# EAGLE design AncientFilter-euro (EAGLE 7.7.0)

## Sheet 1 of 2
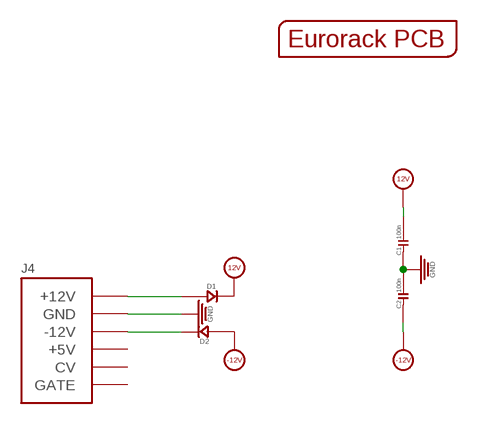
[diagram p0: schematic, sheet 1]

### Parts
C1  100n  C-0603  [C0603]
C2  100n  C-0603  [C0603]
D1  D-SMA  [DO-214AC]
D2  D-SMA  [DO-214AC]
J4  POWERSHROUDED  [POWER_16_SHROUDED]
PCB1  EURORACK_PCB12HP  [EURORACK12HPPCB]

### Nets
12V [power]: C1.2 D1.2(-) ; also sheet 2
-12V [power]: C2.1 D2.1(+) ; also sheet 2
GND: C1.1 C2.2 J4.3(GND) J4.4(GND) J4.5(GND) J4.6(GND) J4.7(GND) J4.8(GND) ; also sheet 2
N$2 [power]: D1.1(+) J4.9(+12V) J4.10(+12V)
N$3 [power]: D2.2(-) J4.1(-12V) J4.2(-12V)
Unconnected: J4.11(+5V) J4.12(+5V) J4.13(CV) J4.14(CV) J4.15(GATE) J4.16(GATE)

## Sheet 2 of 2
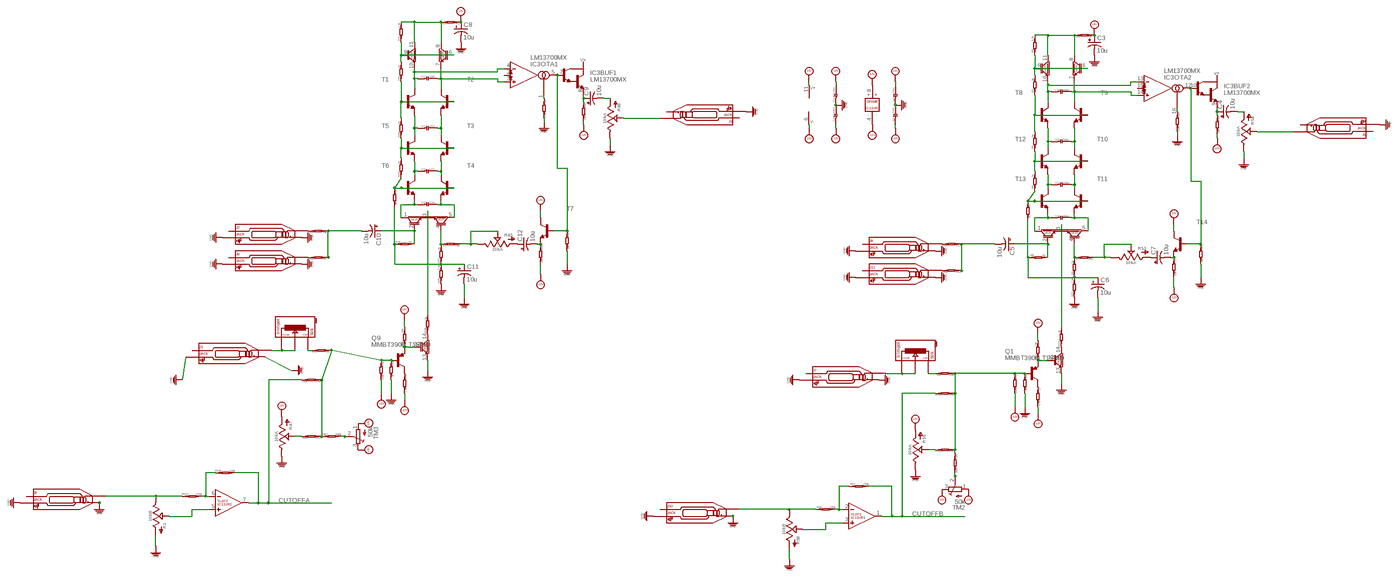
[diagram p1: schematic, sheet 2, overview]
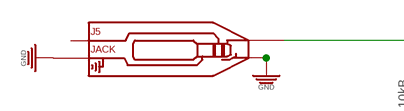
[diagram p2: schematic, sheet 2, part 1 of 4]
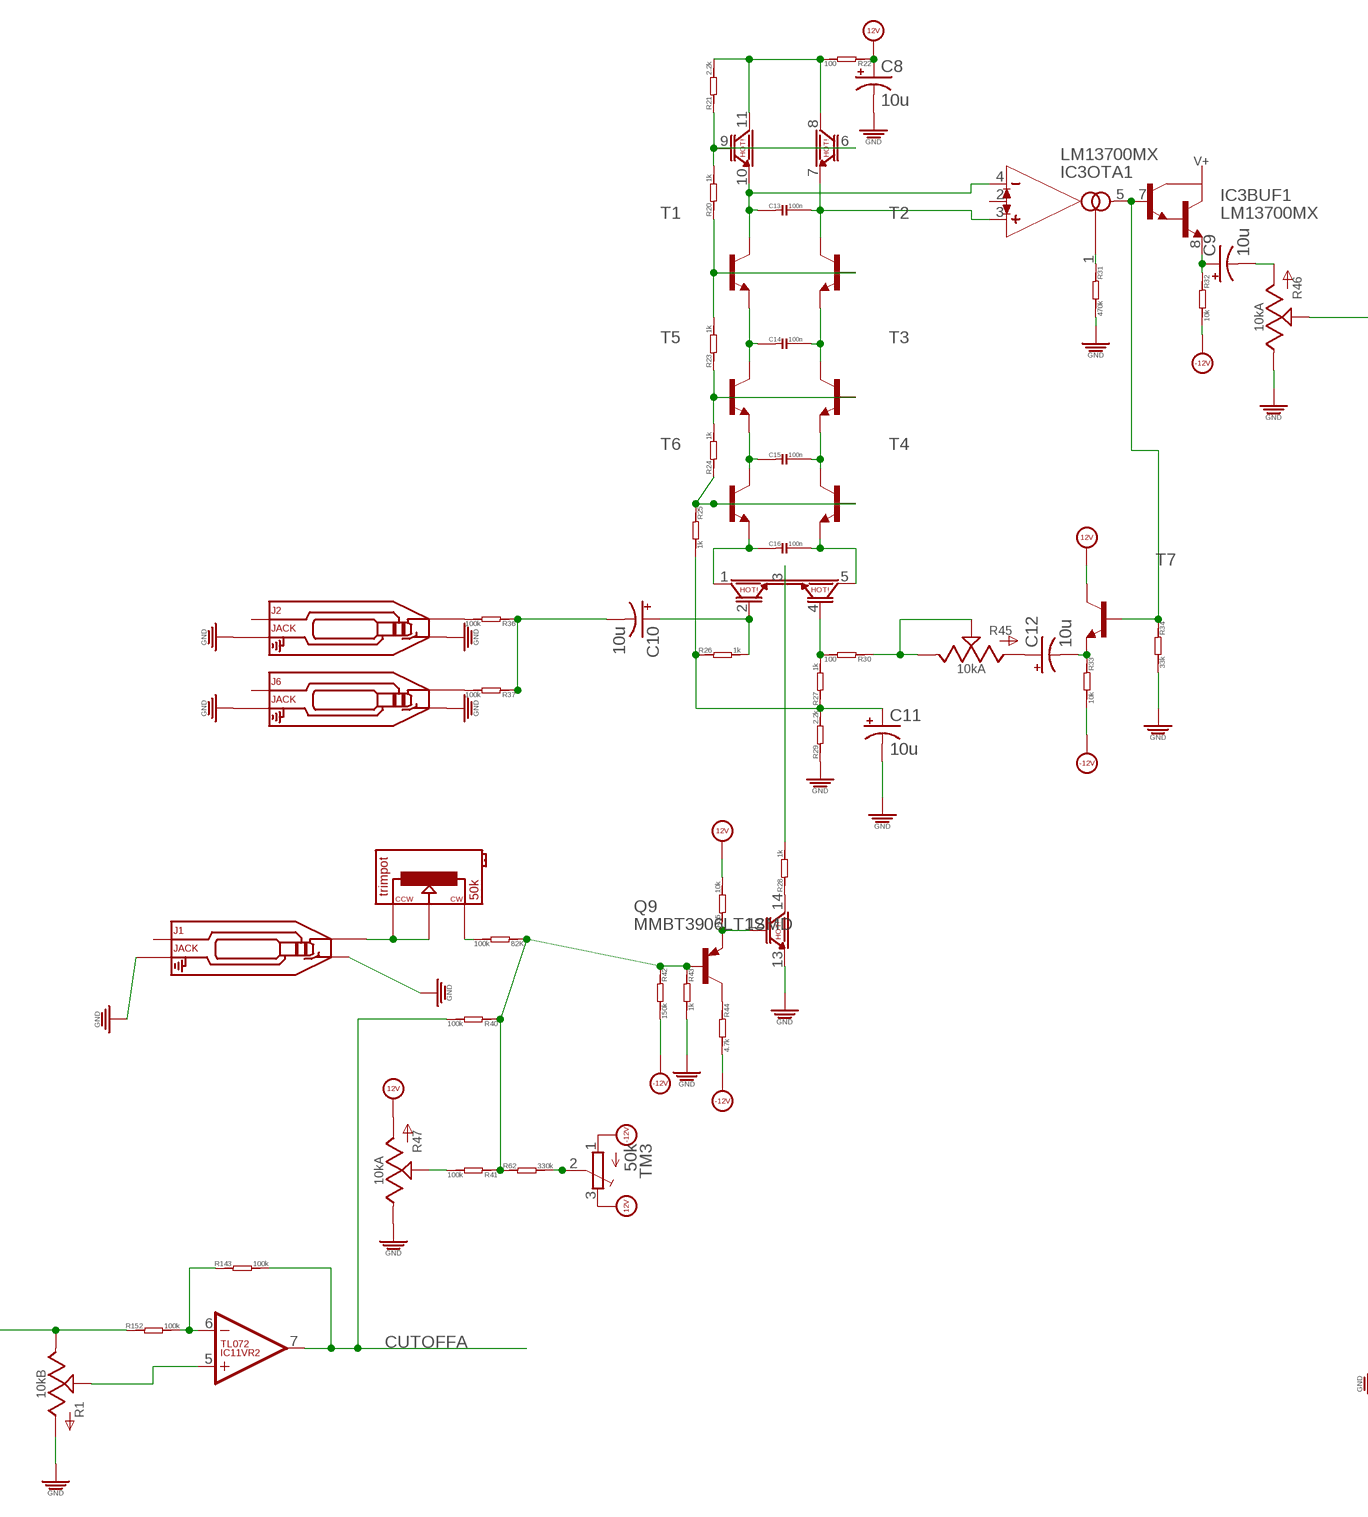
[diagram p3: schematic, sheet 2, part 2 of 4]
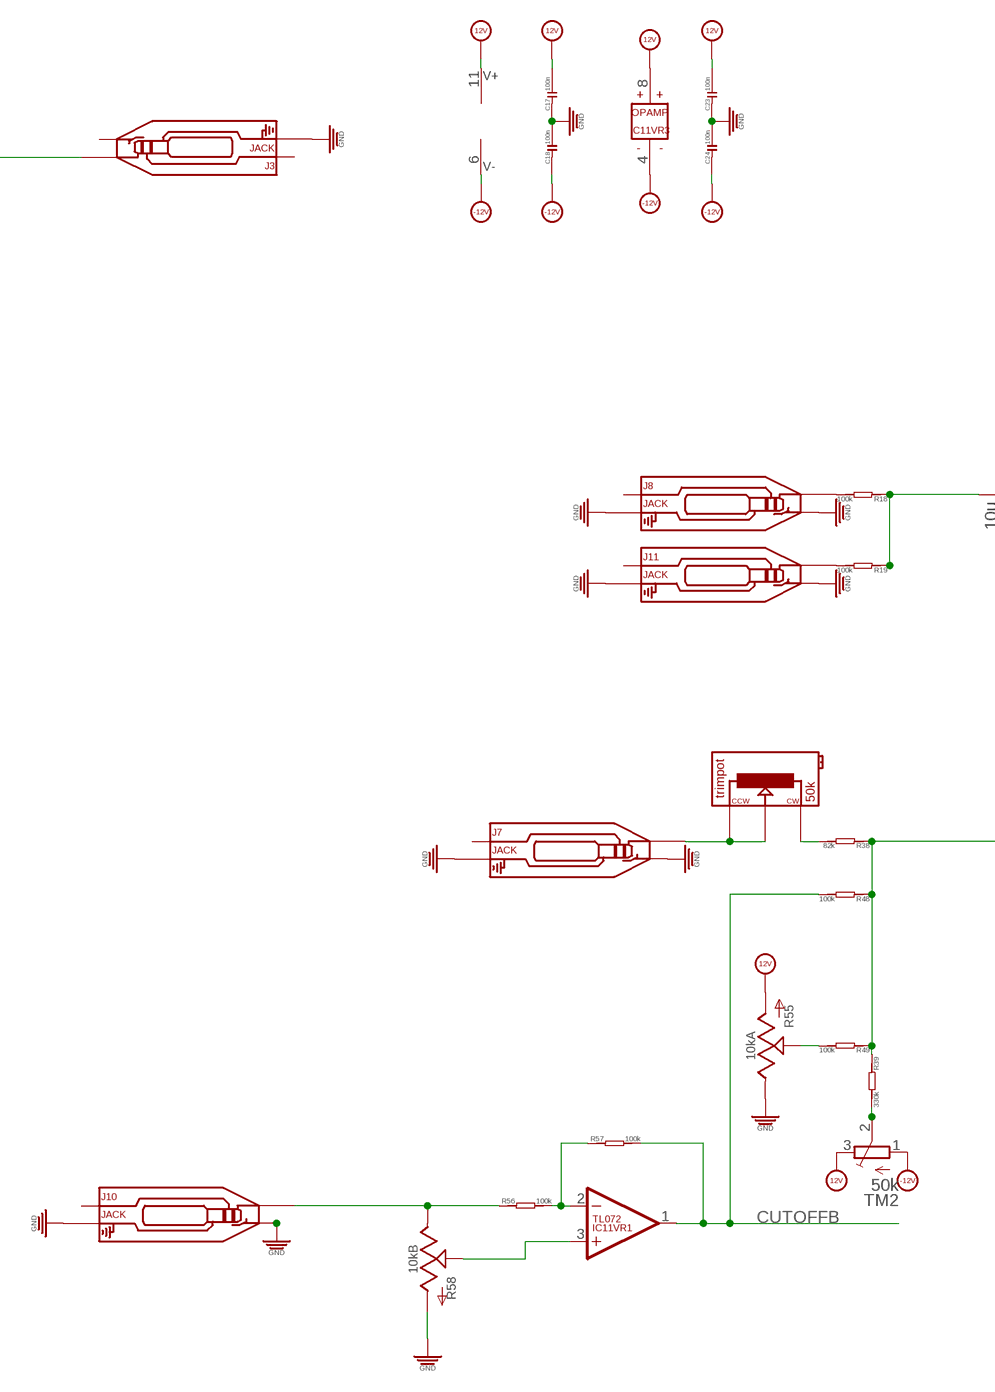
[diagram p4: schematic, sheet 2, part 3 of 4]
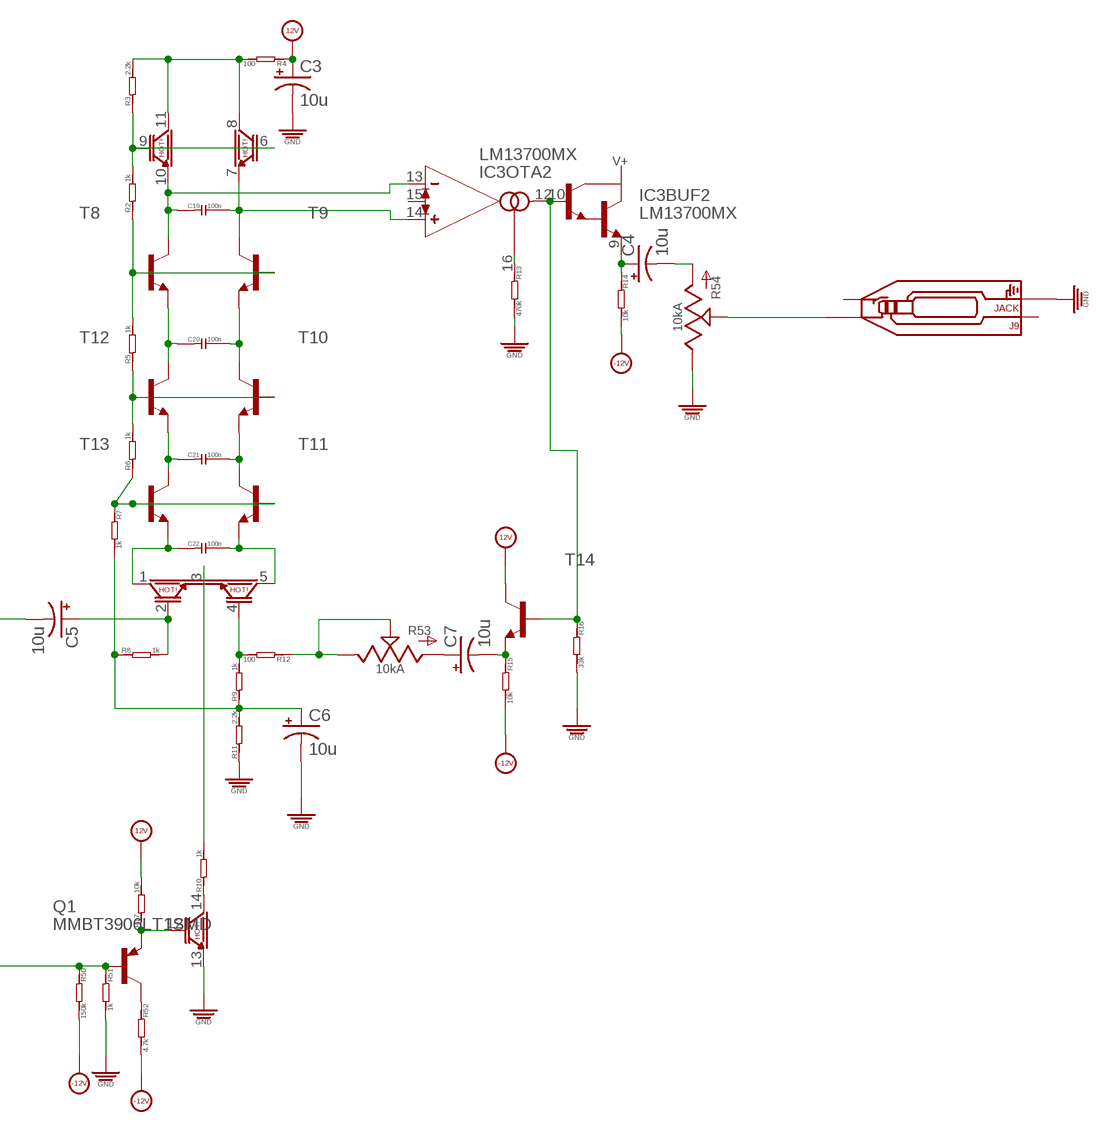
[diagram p5: schematic, sheet 2, part 4 of 4]

### Parts
82K  100k  R-0603  [R0603]
C3  10u  CPOL-US153CLV-0605  [153CLV-0605]
C4  10u  CPOL-US153CLV-0605  [153CLV-0605]
C5  10u  CPOL-US153CLV-0605  [153CLV-0605]
C6  10u  CPOL-US153CLV-0605  [153CLV-0605]
C7  10u  CPOL-US153CLV-0605  [153CLV-0605]
C8  10u  CPOL-US153CLV-0605  [153CLV-0605]
C9  10u  CPOL-US153CLV-0605  [153CLV-0605]
C10  10u  CPOL-US153CLV-0605  [153CLV-0605]
C11  10u  CPOL-US153CLV-0605  [153CLV-0605]
C12  10u  CPOL-US153CLV-0605  [153CLV-0605]
C13  100n  C-0603  [C0603]
C14  100n  C-0603  [C0603]
C15  100n  C-0603  [C0603]
C16  100n  C-0603  [C0603]
C17  100n  C-0603  [C0603]
C18  100n  C-0603  [C0603]
C19  100n  C-0603  [C0603]
C20  100n  C-0603  [C0603]
C21  100n  C-0603  [C0603]
C22  100n  C-0603  [C0603]
C23  100n  C-0603  [C0603]
C24  100n  C-0603  [C0603]
IC3  LM13700MX  [SO16]
IC11  TL072  [SO08]
J1  JACK  AUDIO-JACK_SMALLSYMBOLNODRILL  [3.5MM-JACK-SWITCH-13MM-NOHOLES]
J2  JACK  AUDIO-JACK_SMALLSYMBOLNODRILL  [3.5MM-JACK-SWITCH-13MM-NOHOLES]
J3  JACK  AUDIO-JACK_SMALLSYMBOLNODRILL  [3.5MM-JACK-SWITCH-13MM-NOHOLES]
J5  JACK  AUDIO-JACK_SMALLSYMBOLNODRILL  [3.5MM-JACK-SWITCH-13MM-NOHOLES]
J6  JACK  AUDIO-JACK_SMALLSYMBOLNODRILL  [3.5MM-JACK-SWITCH-13MM-NOHOLES]
J7  JACK  AUDIO-JACK_SMALLSYMBOLNODRILL  [3.5MM-JACK-SWITCH-13MM-NOHOLES]
J8  JACK  AUDIO-JACK_SMALLSYMBOLNODRILL  [3.5MM-JACK-SWITCH-13MM-NOHOLES]
J9  JACK  AUDIO-JACK_SMALLSYMBOLNODRILL  [3.5MM-JACK-SWITCH-13MM-NOHOLES]
J10  JACK  AUDIO-JACK_SMALLSYMBOLNODRILL  [3.5MM-JACK-SWITCH-13MM-NOHOLES]
J11  JACK  AUDIO-JACK_SMALLSYMBOLNODRILL  [3.5MM-JACK-SWITCH-13MM-NOHOLES]
Q1  MMBT3906LT1SMD  [SOT23-BEC]
Q9  MMBT3906LT1SMD  [SOT23-BEC]
R1  10kB  POTSQUAREHOLE_SMALLKNOB  [ALPS_POT_SQUAREHOLES]
R2  1k  R-0603  [R0603]
R3  2.2k  R-0603  [R0603]
R4  100  R-0603  [R0603]
R5  1k  R-0603  [R0603]
R6  1k  R-0603  [R0603]
R7  1k  R-0603  [R0603]
R8  1k  R-0603  [R0603]
R9  1k  R-0603  [R0603]
R10  1k  R-0603  [R0603]
R11  2.2k  R-0603  [R0603]
R12  100  R-0603  [R0603]
R13  470k  R-0603  [R0603]
R14  10k  R-0603  [R0603]
R15  10k  R-0603  [R0603]
R16  33k  R-0603  [R0603]
R17  10k  R-0603  [R0603]
R18  100k  R-0603  [R0603]
R19  100k  R-0603  [R0603]
R20  1k  R-0603  [R0603]
R21  2.2k  R-0603  [R0603]
R22  100  R-0603  [R0603]
R23  1k  R-0603  [R0603]
R24  1k  R-0603  [R0603]
R25  1k  R-0603  [R0603]
R26  1k  R-0603  [R0603]
R27  1k  R-0603  [R0603]
R28  1k  R-0603  [R0603]
R29  2.2k  R-0603  [R0603]
R30  100  R-0603  [R0603]
R31  470k  R-0603  [R0603]
R32  10k  R-0603  [R0603]
R33  10k  R-0603  [R0603]
R34  33k  R-0603  [R0603]
R35  10k  R-0603  [R0603]
R36  100k  R-0603  [R0603]
R37  100k  R-0603  [R0603]
R38  82k  R-0603  [R0603]
R39  330k  R-0603  [R0603]
R40  100k  R-0603  [R0603]
R41  100k  R-0603  [R0603]
R42  150k  R-0603  [R0603]
R43  1k  R-0603  [R0603]
R44  4.7k  R-0603  [R0603]
R45  10kA  POTSQUAREHOLE_SMALLKNOB  [ALPS_POT_SQUAREHOLES]
R46  10kA  POTSQUAREHOLE_SMALLKNOB  [ALPS_POT_SQUAREHOLES]
R47  10kA  POTSQUAREHOLE_SMALLKNOB  [ALPS_POT_SQUAREHOLES]
R48  100k  R-0603  [R0603]
R49  100k  R-0603  [R0603]
R50  150k  R-0603  [R0603]
R51  1k  R-0603  [R0603]
R52  4.7k  R-0603  [R0603]
R53  10kA  POTSQUAREHOLE_SMALLKNOB  [ALPS_POT_SQUAREHOLES]
R54  10kA  POTSQUAREHOLE_SMALLKNOB  [ALPS_POT_SQUAREHOLES]
R55  10kA  POTSQUAREHOLE_SMALLKNOB  [ALPS_POT_SQUAREHOLES]
R56  100k  R-0603  [R0603]
R57  100k  R-0603  [R0603]
R58  10kB  POTSQUAREHOLE_SMALLKNOB  [ALPS_POT_SQUAREHOLES]
R61  50k  TRIMPOT  [TRIMPOT]
R62  330k  R-0603  [R0603]
R63  50k  TRIMPOT  [TRIMPOT]
R143  100k  R-0603  [R0603]
R152  100k  R-0603  [R0603]
T1  MMBT3904LT1-NPN-SOT23-BEC  [SOT23-BEC]
T2  MMBT3904LT1-NPN-SOT23-BEC  [SOT23-BEC]
T3  MMBT3904LT1-NPN-SOT23-BEC  [SOT23-BEC]
T4  MMBT3904LT1-NPN-SOT23-BEC  [SOT23-BEC]
T5  MMBT3904LT1-NPN-SOT23-BEC  [SOT23-BEC]
T6  MMBT3904LT1-NPN-SOT23-BEC  [SOT23-BEC]
T7  MMBT3904LT1-NPN-SOT23-BEC  [SOT23-BEC]
T8  MMBT3904LT1-NPN-SOT23-BEC  [SOT23-BEC]
T9  MMBT3904LT1-NPN-SOT23-BEC  [SOT23-BEC]
T10  MMBT3904LT1-NPN-SOT23-BEC  [SOT23-BEC]
T11  MMBT3904LT1-NPN-SOT23-BEC  [SOT23-BEC]
T12  MMBT3904LT1-NPN-SOT23-BEC  [SOT23-BEC]
T13  MMBT3904LT1-NPN-SOT23-BEC  [SOT23-BEC]
T14  MMBT3904LT1-NPN-SOT23-BEC  [SOT23-BEC]
TM2  50k  TRIMPOTTC33X  [TC33X]
TM3  50k  TRIMPOTTC33X  [TC33X]
U$1  LM3046  [SO14]
U$2  LM3046  [SO14]

### Nets
12V [power]: C3.+ C8.+ C17.2 C23.2 IC3.11(SUPPLY:V+) IC11.8(VR3:V+) R4.1 R17.2 R22.1 R35.2 R47.P$3(A) R55.P$3(A) T7.C T14.C TM2.3(E) TM3.3(E) ; also sheet 1
-12V [power]: C18.1 C24.1 IC3.6(SUPPLY:V-) IC11.4(VR3:V-) R14.2 R15.2 R32.2 R33.2 R42.2 R44.2 R50.2 R52.2 TM2.1(A) TM3.1(A) ; also sheet 1
CUTOFF2_MODENVINPUT: J5.TIP_B@1(TIP) J5.TIP_T@3(TIP) R1.P$1(E) R152.1
CUTOFF2_MODENVINPUT1: J10.TIP_B@1(TIP) J10.TIP_T@3(TIP) R56.1 R58.P$1(E)
CUTOFFA: IC11.7(VR2:OUT) R40.2 R143.2
CUTOFFB: IC11.1(VR1:OUT) R48.2 R57.2
GND: C3.- C6.- C8.- C11.- C17.1 C18.2 C23.1 C24.2 J1.RING_B@1(RING) J1.RING_T@3(RING) J1.SWITCH_B@1(SWITCH) J1.SWITCH_T@3(SWITCH) J2.RING_B@1(RING) J2.RING_T@3(RING) J2.SWITCH_B@1(SWITCH) J2.SWITCH_T@3(SWITCH) J3.RING_B@1(RING) J3.RING_T@3(RING) J5.RING_B@1(RING) J5.RING_T@3(RING) J5.SWITCH_B@1(SWITCH) J5.SWITCH_T@3(SWITCH) J6.RING_B@1(RING) J6.RING_T@3(RING) J6.SWITCH_B@1(SWITCH) J6.SWITCH_T@3(SWITCH) J7.RING_B@1(RING) J7.RING_T@3(RING) J7.SWITCH_B@1(SWITCH) J7.SWITCH_T@3(SWITCH) J8.RING_B@1(RING) J8.RING_T@3(RING) J8.SWITCH_B@1(SWITCH) J8.SWITCH_T@3(SWITCH) J9.RING_B@1(RING) J9.RING_T@3(RING) J10.RING_B@1(RING) J10.RING_T@3(RING) J10.SWITCH_B@1(SWITCH) J10.SWITCH_T@3(SWITCH) J11.RING_B@1(RING) J11.RING_T@3(RING) J11.SWITCH_B@1(SWITCH) J11.SWITCH_T@3(SWITCH) R1.P$3(A) R11.1 R13.2 R16.2 R29.1 R31.2 R34.2 R43.2 R46.P$1(E) R47.P$1(E) R51.2 R54.P$1(E) R55.P$1(E) R58.P$3(A) U$1.13(E) U$2.13(E) ; also sheet 1
N$1: Q9.E R35.1 U$2.12(B)
N$4: J6.TIP_B@1(TIP) J6.TIP_T@3(TIP) R37.2
N$5: Q1.E R17.1 U$1.12(B)
N$6: C7.- R15.1 T14.E
N$7: R49.2 R55.P$2(S)
N$8: R2.2 R3.1 U$1.6(B) U$1.9(B)
N$9: C19.1 IC3.13(OTA2:IN_N) T8.C U$1.10(E)
N$10: C19.2 IC3.14(OTA2:IN_P) T9.C U$1.7(E)
N$11: C20.1 T8.E T12.C
N$12: C20.2 T9.E T10.C
N$13: C21.1 T12.E T13.C
N$14: C21.2 T10.E T11.C
N$15: C22.2 T11.E U$1.5(C1)
N$16: C22.1 T13.E U$1.1(C2)
N$17: C12.- R33.1 T7.E
N$18: R2.1 R5.2 T8.B T9.B
N$19: R5.1 R6.2 T10.B T12.B
N$20: R6.1 R7.1 T11.B T13.B
N$21: R10.2 U$1.3(E)
N$22: R10.1 U$1.14(C)
N$23: Q1.C R52.1
N$24: Q1.B R38.1 R39.1 R48.1 R49.1 R50.1 R51.1
N$25: C5.+ R8.2 U$1.2(B2)
N$26: R41.2 R47.P$2(S)
N$27: R20.2 R21.1 U$2.6(B) U$2.9(B)
N$28: C13.1 IC3.4(OTA1:IN_N) T1.C U$2.10(E)
N$29: C13.2 IC3.3(OTA1:IN_P) T2.C U$2.7(E)
N$30: C14.1 T1.E T5.C
N$31: C14.2 T2.E T3.C
N$32: C15.1 T5.E T6.C
N$33: C15.2 T3.E T4.C
N$34: C16.2 T4.E U$2.5(C1)
N$35: C16.1 T6.E U$2.1(C2)
N$36: R20.1 R23.2 T1.B T2.B
N$37: R23.1 R24.2 T3.B T5.B
N$38: R24.1 R25.1 T4.B T6.B
N$39: C10.+ R26.2 U$2.2(B2)
N$40: R28.2 U$2.3(E)
N$41: R28.1 U$2.14(C)
N$42: Q9.C R44.1
N$43: 82K.1 Q9.B R40.1 R41.1 R42.1 R43.1 R62.1
N$44: C10.- R36.1 R37.1
N$45: C11.+ R25.2 R26.1 R27.1 R29.2
N$46: R27.2 R30.2 U$2.4(B1)
N$47: R21.2 R22.2 U$2.8(C) U$2.11(C)
N$48: C5.- R18.1 R19.1
N$49: IC3.1(OTA1:I_BIAS) R31.1
N$50: C9.- R46.P$3(A)
N$51: IC3.5(OTA1:OUT) IC3.7(BUF1:B) R34.1 T7.B
N$52: C9.+ IC3.8(BUF1:E) R32.1
N$53: J3.TIP_B@1(TIP) J3.TIP_T@3(TIP) R46.P$2(S)
N$54: R30.1 R45.P$1(E) R45.P$2(S)
N$55: C12.+ R45.P$3(A)
N$56: J1.TIP_B@1(TIP) J1.TIP_T@3(TIP) R61.P$1 R61.P$2
N$57: J2.TIP_B@1(TIP) J2.TIP_T@3(TIP) R36.2
N$58: C6.+ R7.2 R8.1 R9.1 R11.2
N$59: R9.2 R12.2 U$1.4(B1)
N$60: R3.2 R4.2 U$1.8(C) U$1.11(C)
N$61: IC3.16(OTA2:I_BIAS) R13.1
N$62: C4.- R54.P$3(A)
N$63: IC3.10(BUF2:B) IC3.12(OTA2:OUT) R16.1 T14.B
N$64: C4.+ IC3.9(BUF2:E) R14.1
N$65: J9.TIP_B@1(TIP) J9.TIP_T@3(TIP) R54.P$2(S)
N$66: R12.1 R53.P$1(E) R53.P$2(S)
N$67: C7.+ R53.P$3(A)
N$68: J7.TIP_B@1(TIP) J7.TIP_T@3(TIP) R63.P$1 R63.P$2
N$69: J8.TIP_B@1(TIP) J8.TIP_T@3(TIP) R18.2
N$70: IC11.2(VR1:-IN) R56.2 R57.1
N$71: IC11.3(VR1:+IN) R58.P$2(S)
N$72: J11.TIP_B@1(TIP) J11.TIP_T@3(TIP) R19.2
N$75: 82K.2 R61.P$3
N$76: R39.2 TM2.2(S)
N$77: R62.2 TM3.2(S)
N$78: R38.2 R63.P$3
N$126: IC11.6(VR2:-IN) R143.1 R152.2
N$127: IC11.5(VR2:+IN) R1.P$2(S)
Unconnected: IC3.2(OTA1:I_DIODE) IC3.15(OTA2:I_DIODE) J1.SECOND_B@1(SECOND) J1.SECOND_T@3(SECOND) J2.SECOND_B@1(SECOND) J2.SECOND_T@3(SECOND) J3.SECOND_B@1(SECOND) J3.SECOND_T@3(SECOND) J3.SWITCH_B@1(SWITCH) J3.SWITCH_T@3(SWITCH) J5.SECOND_B@1(SECOND) J5.SECOND_T@3(SECOND) J6.SECOND_B@1(SECOND) J6.SECOND_T@3(SECOND) J7.SECOND_B@1(SECOND) J7.SECOND_T@3(SECOND) J8.SECOND_B@1(SECOND) J8.SECOND_T@3(SECOND) J9.SECOND_B@1(SECOND) J9.SECOND_T@3(SECOND) J9.SWITCH_B@1(SWITCH) J9.SWITCH_T@3(SWITCH) J10.SECOND_B@1(SECOND) J10.SECOND_T@3(SECOND) J11.SECOND_B@1(SECOND) J11.SECOND_T@3(SECOND)

## Library data of the parts
82K R2-R44 R48-R52 R56 R57 R62 R143 R152 = OPL:R*
C1 C2 C13-C24 = OPL:C*
C3-C12 = adafruit:CPOL-US: POLARIZED CAPACITOR, American symbol
D1 D2 = OPL:D*: DIODE
IC3 = ota:LM13700: Dual OTA with buffers
IC11 = EurorackModularParts:TL072
J1 = EurorackModularParts:AUDIO-JACK_SMALLSYMBOL: Switching Mono 3.5mm Audio Jack from Erthenvar.; DESC: A: Cutoff
J2 = EurorackModularParts:AUDIO-JACK_SMALLSYMBOL: Switching Mono 3.5mm Audio Jack from Erthenvar.; DESC: A: Input 1
J3 = EurorackModularParts:AUDIO-JACK_SMALLSYMBOL: Switching Mono 3.5mm Audio Jack from Erthenvar.; DESC: A: Output
J4 = EurorackModularParts:POWER
J5 = EurorackModularParts:AUDIO-JACK_SMALLSYMBOL: Switching Mono 3.5mm Audio Jack from Erthenvar.; DESC: A: Cutoff Attnv
J6 = EurorackModularParts:AUDIO-JACK_SMALLSYMBOL: Switching Mono 3.5mm Audio Jack from Erthenvar.; DESC: A: Input 2
J7 = EurorackModularParts:AUDIO-JACK_SMALLSYMBOL: Switching Mono 3.5mm Audio Jack from Erthenvar.; DESC: B: Cutoff
J8 = EurorackModularParts:AUDIO-JACK_SMALLSYMBOL: Switching Mono 3.5mm Audio Jack from Erthenvar.; DESC: B: Input 1
J9 = EurorackModularParts:AUDIO-JACK_SMALLSYMBOL: Switching Mono 3.5mm Audio Jack from Erthenvar.; DESC: B: Output
J10 = EurorackModularParts:AUDIO-JACK_SMALLSYMBOL: Switching Mono 3.5mm Audio Jack from Erthenvar.; DESC: B: Cutoff Attnv
J11 = EurorackModularParts:AUDIO-JACK_SMALLSYMBOL: Switching Mono 3.5mm Audio Jack from Erthenvar.; DESC: B: Input 2
PCB1 = EurorackModularParts:EURORACK_PCB
Q1 Q9 = transistor-pnp:MMBT3906*: PNP Transistror
R1 = EurorackModularParts:POT; DESC: A: Cutoff Attnv
R45 = EurorackModularParts:POT; DESC: A: Resonance
R46 = EurorackModularParts:POT; DESC: A: Volume
R47 = EurorackModularParts:POT; DESC: A: Cutoff
R53 = EurorackModularParts:POT; DESC: B: Resonance
R54 = EurorackModularParts:POT; DESC: B: Volume
R55 = EurorackModularParts:POT; DESC: B: Cutoff
R58 = EurorackModularParts:POT; DESC: B: Cutoff Attnv
R61 = EurorackModularParts:TRIMPOT; DESC: A scale
R63 = EurorackModularParts:TRIMPOT; DESC: B scale
T1-T14 = transistor:*-NPN-: NPN Transistror BF959 corrected 2008.03.06
TM2 = adafruit:TRIMPOT: SMT trimmer potentiometer part number TC33X http://www.ladyada.net/library/eagle; DESC: B offset
TM3 = adafruit:TRIMPOT: SMT trimmer potentiometer part number TC33X http://www.ladyada.net/library/eagle; DESC: A offset
U$1 U$2 = FenixBase:LM3046

## Net classes
0 default: width 0.254 mm
1 power: width 0.508 mm

## Board
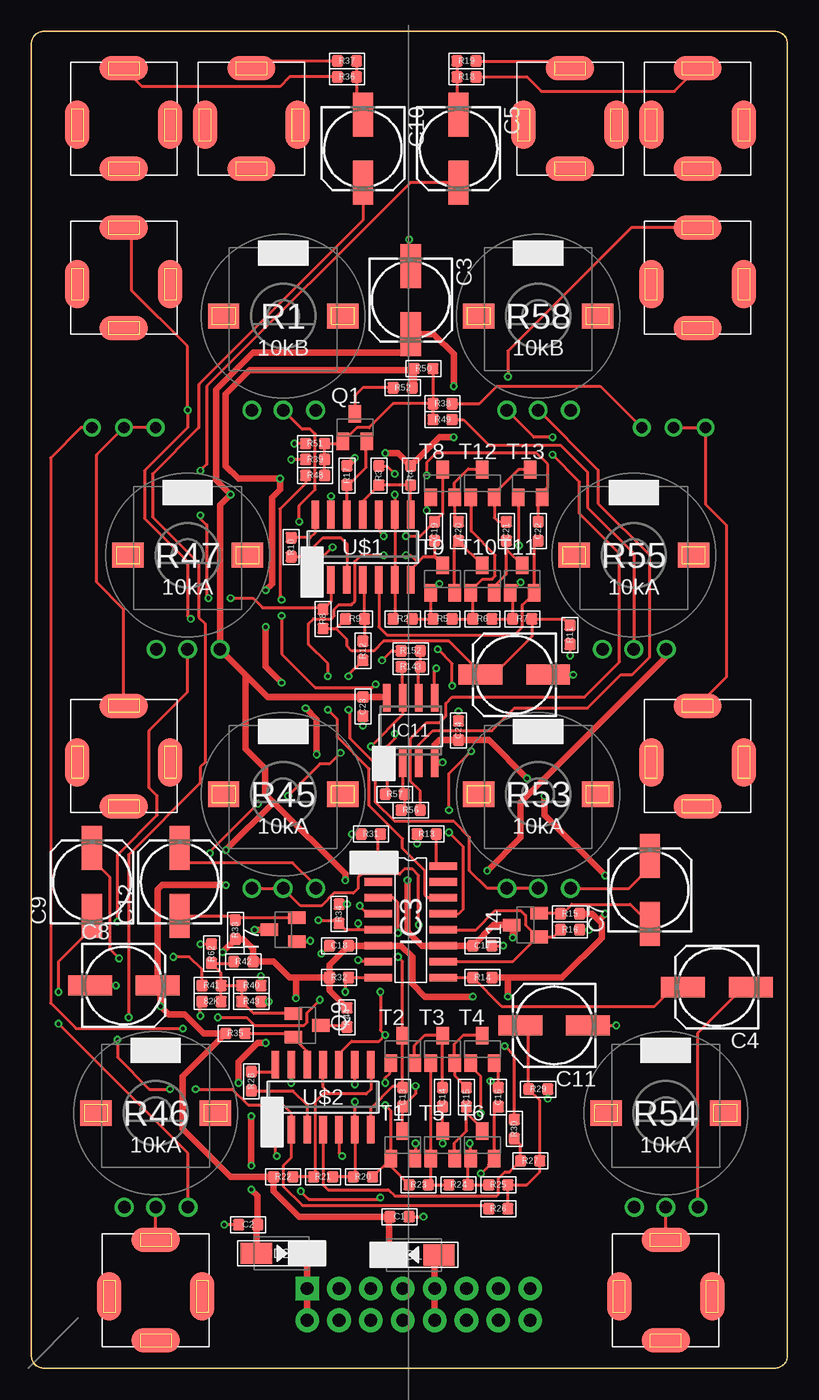
[diagram p6: board, top side]
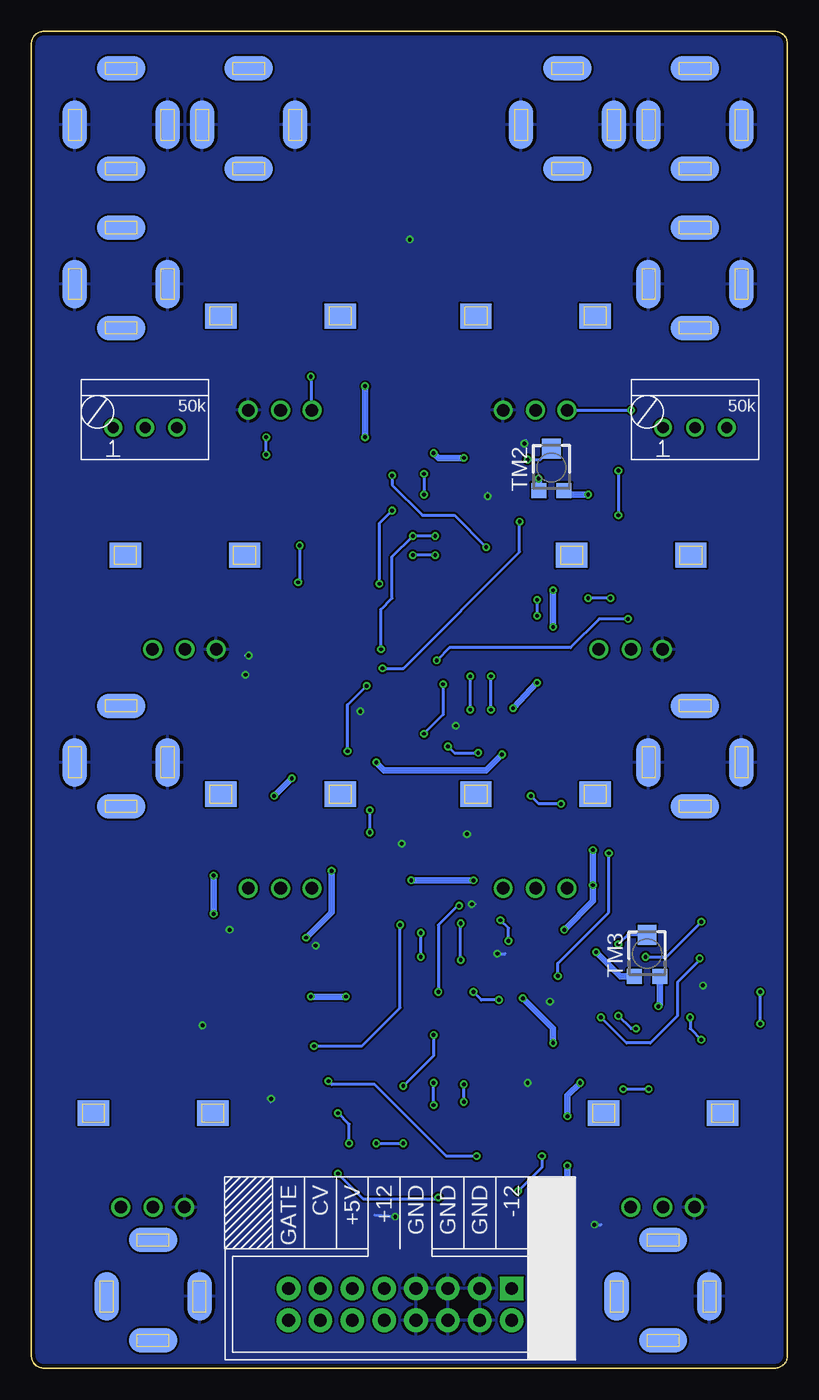
[diagram p7: board, bottom side, seen from below]

Size 60.25 x 106.5 mm. Coordinates in mm from the lower left corner, seen from the top.
Copper layers (1*16): Top 0.035mm / dielectric 1.5mm / Bottom 0.035mm
Design rules "dirt_cheap_dirty_boards.v1.1": minimum track width 6mil, minimum drill 12mil, track to track 6mil, track to pad 6mil, pad to pad 6mil, via to via 6mil, smd to smd 0mil, copper to edge 10mil, drill to drill 10mil, minimum pad ring 10mil, minimum via ring 6mil, stop-mask expansion 2mil, vias tented up to drill 25mil, thermal gap 10mil

### Footprints (pad centres in the part's own frame; a part is rotated, then mirrored left to right if it is on the bottom)
R0603 = smd 0.889 x 0.889: 1 -0.762,0; 2 0.762,0
C0603 = smd 0.889 x 0.889: 1 -0.762,0; 2 0.762,0
153CLV-0605 = smd 3.5 x 1.6: + 2.7,0; - -2.7,0
DO-214AC = smd 2.5 x 1.7: 1 -2,0; 2 2,0
SO16 = smd 0.6 x 2.2: 1 -4.445,-2.6; 2 -3.175,-2.6; 3 -1.905,-2.6; 4 -0.635,-2.6; 5 0.635,-2.6; 6 1.905,-2.6; 7 3.175,-2.6; 8 4.445,-2.6; 9 4.445,2.6; 10 3.175,2.6; 11 1.905,2.6; 12 0.635,2.6; 13 -0.635,2.6; 14 -1.905,2.6; 15 -3.175,2.6; 16 -4.445,2.6
SO08 = smd 0.6 x 2.2: 1 -1.905,-2.6; 2 -0.635,-2.6; 3 0.635,-2.6; 4 1.905,-2.6; 5 1.905,2.6; 6 0.635,2.6; 7 -0.635,2.6; 8 -1.905,2.6
3.5MM-JACK-SWITCH-13MM-NOHOLES = smd 1.95 x 3.85 bottom: RING_B@1 -3.7,0; SWITCH_B@1 3.7,0 | smd 1.95 x 3.85: RING_T@3 -3.7,0; SWITCH_T@3 3.7,0 | smd 3.85 x 1.95 bottom: SECOND_B@1 0,-3.5; TIP_B@1 0,4.5 | smd 3.85 x 1.95: SECOND_T@3 0,-3.5; TIP_T@3 0,4.5
POWER_16_SHROUDED = drill 1.016 pad 1.88 square: 1 -8.89,-1.27 | drill 1.016 pad 1.88: 2 -8.89,1.27; 3 -6.35,-1.27; 4 -6.35,1.27; 5 -3.81,-1.27; 6 -3.81,1.27; 7 -1.27,-1.27; 8 -1.27,1.27; 9 1.27,-1.27; 10 1.27,1.27; 11 3.81,-1.27; 12 3.81,1.27; 13 6.35,-1.27; 14 6.35,1.27; 15 8.89,-1.27; 16 8.89,1.27
SOT23-BEC = smd 1 x 1.4: B -0.95,-1.1; C 0,1.1; E 0.95,-1.1
ALPS_POT_SQUAREHOLES = drill 1: P$1 -2.5,-7.5; P$2 0,-7.5; P$3 2.58,-7.5 | smd 2.5 x 2: P$4 -4.75,0; P$5 4.75,0 | smd 2.5 x 2 bottom: P$6 -4.75,0; P$7 4.75,0
TRIMPOT = drill 0.9: P$1 -2.54,0; P$2 0,0; P$3 2.54,0
TC33X = smd 1.2 x 1.2: 1 -1,-1.825; 3 1,-1.825 | smd 1.5 x 1.6: 2 0,1.5
SO14 = smd 0.6 x 2.2: 1 -3.81,-2.6; 2 -2.54,-2.6; 3 -1.27,-2.6; 4 0,-2.6; 5 1.27,-2.6; 6 2.54,-2.6; 7 3.81,-2.6; 8 3.81,2.6; 9 2.54,2.6; 10 1.27,2.6; 11 0,2.6; 12 -1.27,2.6; 13 -2.54,2.6; 14 -3.81,2.6

### Placement (x,y rotation side)
82K  14.36,29.21 180 top
C1  29.34,12.06 180 top
C2  17.28,11.43 180 top
C3  30.23,85.09 270 top
C4  54.61,30.35 180 top
C5  34.04,97.16 270 top
C6  38.48,55.24 180 top
C7  49.28,38.1 90 top
C8  7.37,30.48 0 top
C9  4.83,38.73 90 top
C10  26.42,97.16 270 top
C11  41.66,27.3 180 top
C12  11.81,38.73 90 top
C13  29.59,21.59 90 top
C14  32.77,21.59 90 top
C15  34.67,21.59 90 top
C16  37.22,21.59 90 top
C17  35.95,33.66 180 top
C18  24.52,33.66 180 top
C19  32.13,66.67 270 top
C20  34.04,66.67 270 top
C21  37.85,66.67 270 top
C22  40.39,66.67 270 top
C23  26.42,52.7 90 top
C24  34.04,50.8 90 top
D1  30.48,9.02 180 top
D2  19.94,9.14 0 top
IC3  30.23,35.56 270 top
IC11  30.23,50.8 0 top
J1  7.37,48.26 0 top
J2  7.37,99.06 0 top
J3  9.91,5.71 0 top
J4  30.86,5.08 180 bottom
J5  7.37,86.36 0 top
J6  17.53,99.06 0 top
J7  53.09,48.26 0 top
J8  53.09,99.06 0 top
J9  50.55,5.71 0 top
J10  53.09,86.36 0 top
J11  42.93,99.06 0 top
PCB1  -0.25,0 0 top
Q1  25.79,74.93 0 top
Q9  21.98,27.3 270 top
R1  20.07,83.82 0 top
R2  29.59,59.69 180 top
R3  27.69,71.12 270 top
R4  30.23,71.12 270 top
R5  32.77,59.69 180 top
R6  35.95,59.69 180 top
R7  39.12,59.69 0 top
R8  23.25,59.69 90 top
R9  25.79,59.69 0 top
R10  20.7,65.41 270 top
R11  42.93,58.42 90 top
R12  26.42,57.15 90 top
R13  31.5,42.55 180 top
R14  35.95,31.11 0 top
R15  42.93,36.2 0 top
R16  42.93,34.92 0 top
R17  25.15,71.12 90 top
R18  34.67,102.87 0 top
R19  34.67,104.14 0 top
R20  26.42,15.24 180 top
R21  23.25,15.24 180 top
R22  20.07,15.24 0 top
R23  30.86,14.61 180 top
R24  34.04,14.61 180 top
R25  37.22,14.61 0 top
R26  37.22,12.7 180 top
R27  39.76,16.51 180 top
R28  17.53,22.86 270 top
R29  40.39,22.23 180 top
R30  38.48,19.05 270 top
R31  27.05,42.55 180 top
R32  24.52,31.11 180 top
R33  16.26,34.92 270 top
R34  24.52,36.2 90 top
R35  16.26,26.67 180 top
R36  25.15,102.87 180 top
R37  25.15,104.14 180 top
R38  32.77,76.83 0 top
R39  22.61,72.39 180 top
R40  17.53,30.48 0 top
R41  14.36,30.48 180 top
R42  16.89,32.38 0 top
R43  17.53,29.21 0 top
R44  25.15,27.94 90 top
R45  20.07,45.72 0 top
R46  9.91,20.32 0 top
R47  12.45,64.77 0 top
R48  22.61,71.12 180 top
R49  32.77,75.56 0 top
R50  31.25,79.63 180 top
R51  22.61,73.66 180 top
R52  29.59,78.11 0 top
R53  40.39,45.72 0 top
R54  50.55,20.32 0 top
R55  48.01,64.77 0 top
R56  30.23,44.45 180 top
R57  28.96,45.72 180 top
R58  40.39,83.82 0 top
R61  7.37,74.93 0 bottom
R62  14.36,33.02 90 top
R63  51.19,74.93 0 bottom
R143  30.23,55.88 180 top
R152  30.23,57.15 0 top
T1  29.59,17.78 0 top
T2  29.59,25.4 0 top
T3  32.77,25.4 0 top
T4  35.95,25.4 0 top
T5  32.77,17.78 0 top
T6  35.95,17.78 0 top
T7  20.07,34.92 90 top
T8  32.77,70.48 0 top
T9  32.77,62.87 0 top
T10  35.95,62.87 0 top
T11  39.12,62.87 0 top
T12  35.95,70.48 0 top
T13  39.76,70.48 0 top
T14  39.37,35.31 90 top
TM2  18.8,71.75 0 bottom
TM3  11.18,33.02 0 bottom
U$1  26.42,65.41 0 top
U$2  23.25,21.59 0 top

### Tracks (layer width: path | path; a pad name or v marks a point on that pad's centre or on a via)
12V  (via drill 0.3)
  Top 0.508: D1.2 28.48,11.97 C1.2 21.34,12.06 19.31,14.1 R22.1 15.88,15.24 12.07,19.05 12.07,23.24 R35.2 13.72,26.67 12.2,28.19 10.93,28.19 v10.29,28.83 10.29,30.26 C8.+ 10.07,38.13 10.42,38.48 v15.5,38.48 | v33.66,78.23 33.66,80.77 32.04,82.39 C3.+ 30.23,81.66 29.47,80.9 17.66,80.9 14.74,77.98 14.74,70.74 v15.88,69.6 15.03,68.75 R47.P$3 17.08,55.22 | v33.66,74.17 32.52,74.17 R4.1 29.21,72.9 v28.2,72.9 | R17.2 v25.79,72.52 | 17.08,55.22 18.83,53.47 C23.2 28.26,53.47 IC11.8 | 19.31,45.09 18.64,45.76 18.64,47.79 17.08,49.34 17.08,55.22 | 19.31,45.09 25.02,39.37 v25.02,38.86 | v29.98,38.86 29.98,34.8 31.12,33.66 IC3.11 C17.2 36.83,35.31 T14.C 38.36,35.22 v38.36,34.29 | T7.C v17.78,34.92 | v15.5,41.27 19.31,45.09 | R55.P$3 50.59,56.68 38.99,45.09 38.99,42.29 v36.33,39.62
  Bottom 0.508: TM3.3 10.18,28.94 v10.29,28.83 | v33.66,78.23 v33.66,74.17 | v25.79,72.52 27.82,72.52 v28.2,72.9 | v15.88,69.6 17.47,69.6 TM2.3 | v25.02,38.86 v29.98,38.86 | v17.78,34.92 15.5,37.21 v15.5,38.48 v15.5,41.27 | v36.33,39.62 36.33,36.32 v38.36,34.29
-12V  (via drill 0.3)
  Top 0.508: D2.1 17.94,11.34 C2.1 18.04,13.72 v17.53,14.22 | R50.2 30.48,78.23 R52.2 30.36,79.38 30.23,79.5 17.4,79.5 15.5,77.6 15.5,71.88 16.51,70.87 v19.82,70.87 19.82,69.98 19.18,69.34 19.18,62.48 v18.67,61.98 | 21.21,31.11 20.58,31.11 19.31,32.38 R42.2 17.66,33.4 16.89,34.16 R33.2 v15.24,33.15 | 21.21,31.11 R32.2 | R32.2 23.75,32.13 C18.1 IC3.6 29.47,33.66 30.36,32.77 30.36,30.61 31.37,29.59 v35.18,29.59 | R32.2 23.75,30.1 R44.2 | R14.2 38.1,31.11 | 38.1,31.11 42.3,31.11 45.47,34.29 45.47,35.43 45.22,35.69 | 45.22,35.69 44.71,36.2 R15.2 | v37.98,29.59 37.98,30.99 38.1,31.11 | v39.5,46.99 36.45,50.04 C24.1 32.52,50.04 32.13,49.66 IC11.4 32.2,48.26 v32.77,48.26 | v40.9,45.59 40.9,44.07 v45.72,39.24 | v45.72,36.2 45.22,35.69 | v17.53,16.13 v17.53,20.07 | v16.51,22.73 16.51,24.38 18.04,25.91 v18.67,25.91 | v21.09,29.46 21.09,30.99 21.21,31.11 | v18.67,59.05 18.67,55.88 v19.94,54.61 | v21.85,52.58 22.74,51.69 v22.74,48.9
  Bottom 0.508: 19.82,70.17 TM2.1 19.82,69.95 v19.82,70.87 | TM3.1 13.29,31.2 v15.24,33.15 | v35.18,29.59 v37.98,29.59 | v39.5,46.99 v40.9,45.59 | v45.72,39.24 v45.72,36.2 | v17.53,14.22 v17.53,16.13 | v17.53,20.07 17.53,21.72 v16.51,22.73 | v18.67,25.91 18.67,27.05 v21.09,29.46 | v18.67,61.98 v18.67,59.05 | v19.94,54.61 v21.85,52.58 | v22.74,48.9 24.01,47.62 32.13,47.62 v32.77,48.26
CUTOFF2_MODENVINPUT  (via drill 0.3)
  Top 0.254: J5.TIP_T@3 8.01,90.22 8.01,85.85 12.45,81.41 v12.45,76.33 12.45,74.93 9.02,71.5 9.02,67.69 12.45,64.26 12.45,59.94 v12.7,59.69 | v27.94,56.39 28.71,57.15 R152.1
  Bottom 0.254: R1.P$1 13.09,76.32 v12.45,76.33 | v12.7,59.69 14.99,59.69 17.28,57.4 26.93,57.4 v27.94,56.39
CUTOFF2_MODENVINPUT1  (via drill 0.3)
  Top 0.254: J10.TIP_T@3 47.81,90.86 37.98,81.03 v37.98,78.99 | R56.1 30.99,45.97 30.23,46.74 30.23,50.16 31.5,51.44 32.52,51.44 33.02,51.94 33.02,52.96 33.53,53.47 44.07,53.47 46.87,56.26 46.87,64.9 43.69,68.07 43.69,70.61 v41.53,72.77 | v41.53,74.17 40.04,74.17 R58.P$1
  Bottom 0.254: v37.98,78.99 37.98,76.41 R58.P$1 | v41.53,72.77 v41.53,74.17
CUTOFFA  (via drill 0.3)
  Top 0.254: R143.2 29.59,55.75 IC11.7 29.59,52.07 v27.05,49.53 | v24.64,49.02 23.75,48.13 22.99,48.13 v20.45,45.59 | R40.2 v18.29,31.24 | v14.23,41.02 14.23,41.15 v18.04,44.96
  Bottom 0.254: v27.05,49.53 26.55,49.02 v24.64,49.02 | v18.29,31.24 18.29,32.26 14.23,36.32 v14.23,41.02 | v18.04,44.96 19.82,44.96 v20.45,45.59
CUTOFFB  (via drill 0.3)
  Top 0.254: R57.2 28.32,45.85 IC11.1 28.32,49.53 28.96,50.16 v28.96,50.55 | R48.2 21.85,70.48 19.82,68.45 19.82,61.47 v19.94,61.21 | v19.94,59.94 19.94,56.9 22.61,54.23 27.18,54.23 v27.44,54.48
  Bottom 0.254: v19.94,61.21 v19.94,59.94 | v27.44,54.48 27.44,52.07 v28.96,50.55
GND  (via drill 0.3)
  Top 0.254: R51.2 v20.96,73.66 | U$1.13 v23.88,69.47 | C3.- 30.1,87.79 v30.1,89.92 | R11.1 v42.93,56.77 | C6.- v43.18,55.24 | C24.2 v34.04,52.32 | C23.1 v26.42,51.18 | R13.2 v30.74,41.78 | R31.2 v25.53,42.55 | R16.2 v44.45,34.92 | C17.1 v37.6,33.66 | R34.2 v25.15,36.96 | C18.2 v23.12,33.02 | R43.2 v18.93,29.21 | C8.- v6.74,30.48 | U$2.13 v20.7,22.73 | C1.1 v31.25,12.06 | C2.2 v15.37,11.43 | R29.1 v41.15,21.46 | C11.- v46.61,27.3
  Bottom 0.254: v20.96,73.66 20.83,73.66 20.83,73.91 | v23.88,69.47 23.88,69.72 | v30.1,89.92 30.1,90.17 | v42.93,56.77 43.18,56.77 | v43.18,55.24 43.31,55.24 | v34.04,52.32 34.04,52.58 | v26.42,51.18 26.42,50.93 | v30.74,41.78 30.74,41.66 | v25.53,42.55 25.4,42.55 25.4,42.67 | v44.45,34.92 44.58,34.92 | v37.6,33.66 37.72,33.66 37.72,33.53 | v25.15,36.96 24.9,36.96 | v23.12,33.02 22.48,33.02 | v18.93,29.21 19.05,29.21 | v6.74,30.48 6.86,30.48 | v20.7,22.73 20.7,22.61 | v31.25,12.06 32.9,12.19 | v15.37,11.43 14.86,11.43 | v41.15,21.46 41.15,21.21 | v46.61,27.3 46.74,27.3
  pour Bottom: -4.7,110.49 62.62,110.49 62.62,-3.17 -4.7,-3.17
N$1
  Top 0.254: R35.1 20.56,26.67 Q9.E 21.98,25.25 U$2.12
N$2
  Top 0.508: J4.10 J4.9 32.13,8.67 D1.1
N$3
  Top 0.508: J4.2 J4.1 21.98,9.11 D2.2
N$4
  Top 0.254: R37.2 18.11,104.14 J6.TIP_T@3
N$5
  Top 0.254: U$1.12 R17.1 25.28,70.36 26.67,71.75 26.67,73.77 Q1.E
N$6
  Top 0.254: T14.E 42.11,36.26 R15.1 42.3,36.2 43.06,36.96 47.72,36.96 C7.-
N$7
  Top 0.254: R49.2 34.42,75.56 36.45,73.53 42.17,73.53 44.33,71.37 44.33,68.58 48.01,64.9 R55.P$2
N$8  (via drill 0.3)
  Top 0.254: R3.1 28.32,71.88 v28.96,71.25 | v28.96,69.6 U$1.9 | U$1.9 28.96,67.18 | U$1.9 U$1.6 28.96,59.82 R2.2
  Bottom 0.254: v28.96,71.25 v28.96,69.6
N$9  (via drill 0.3)
  Top 0.254: T8.C 32.77,68.07 C19.1 30.99,66.29 v29.85,66.29 | U$1.10 27.69,66.67 v28.07,66.29 | IC3.13 34.04,36.2 34.42,36.58 34.42,41.53 v33.28,42.67 | v33.28,44.45 33.28,47.37 v35.06,49.15 | v33.53,54.36 33.53,56.13 v32.39,57.28
  Bottom 0.254: v28.07,66.29 v29.85,66.29 31.5,64.64 31.5,61.34 32.39,60.45 v32.39,57.28 | v33.28,42.67 v33.28,44.45 | v35.06,49.15 35.06,52.83 v33.53,54.36
N$10  (via drill 0.3)
  Top 0.254: C19.2 32.13,64.6 T9.C 32.09,64.64 31.25,64.64 30.8,64.2 | U$1.7 30.23,63.63 30.8,64.2 | IC3.14 31.63,37.47 31.37,37.72 31.37,39.62 29.59,41.4 29.59,42.16 26.93,44.83 26.93,47.75 24.39,50.29 24.39,51.69 v23.63,52.45 | v23.63,55.12 23.63,56.13 22.1,57.66 22.1,59.31 22.48,59.69 23.88,59.69 24.13,59.94 24.13,60.45 24.52,60.83 25.53,60.83 25.79,61.09 25.79,64.26 26.29,64.77 v28.07,64.77 | v29.85,64.77 30.23,64.77 30.8,64.2
  Bottom 0.254: v23.63,52.45 v23.63,55.12 | v28.07,64.77 v29.85,64.77
N$11
  Top 0.254: C20.1 33.72,67.76 T8.E 33.72,70.55 34.8,71.63 35.9,71.63 T12.C
N$12
  Top 0.254: T10.C 34.04,65.87 C20.2 33.72,65.59 T9.E
N$13
  Top 0.254: C21.1 37.22,67.44 36.9,67.76 T12.E 37.22,69.7 37.22,69.98 38.82,71.58 T13.C
N$14
  Top 0.254: T11.C 37.85,65.23 C21.2 37.85,63.25 36.9,62.29 T10.E
N$15
  Top 0.254: C22.2 40.07,65.59 T11.E 39.12,60.81 39.12,59.05 38.48,58.42 28.32,58.42 27.69,59.05 U$1.5
N$16  (via drill 0.3)
  Top 0.254: C22.1 40.39,69.07 T13.E 40.7,69.78 41.15,70.23 41.15,72.01 40.26,72.9 32.26,72.9 31.5,72.14 v31.5,71.12 | v24.01,65.41 22.61,64.01 U$1.1
  Bottom 0.254: v31.5,71.12 31.5,70.36 29.09,67.94 26.55,67.94 v24.01,65.41
N$17
  Top 0.254: C12.- 15.91,36.03 R33.1 16.45,35.88 T7.E
N$18  (via drill 0.3)
  Top 0.254: R2.1 R5.2 31.82,59.88 T9.B 31.82,61.79 v32.52,62.48 | v31.5,68.33 31.5,69.06 T8.B
  Bottom 0.254: v32.52,62.48 32.52,67.31 v31.5,68.33
N$19
  Top 0.254: R5.1 R6.2 35.18,61.58 T10.B 34.99,61.91 35.95,62.87 36.71,62.87 36.96,63.12 36.96,64.77 35.06,66.67 35.06,69.32 T12.B
N$20  (via drill 0.3)
  Top 0.254: R6.1 R7.1 38.36,61.58 T11.B 38.99,62.59 v38.99,62.61 | T13.B 38.8,65.59 v38.87,65.53
  Bottom 0.254: v38.87,65.53 38.87,62.74 v38.99,62.61
N$21
  Top 0.254: R10.2 21.72,64.64 23.25,66.17 24.64,66.17 25.15,65.66 U$1.3 25.15,62.74
N$22
  Top 0.254: U$1.14 22.61,66.55 22.23,66.17 R10.1
N$23
  Top 0.254: R52.1 26.42,78.11 25.79,77.47 Q1.C
N$24
  Top 0.254: R50.1 R49.1 R38.1 28.83,76.83 26.93,74.93 25.93,74.93 Q1.B 24.66,73.66 R51.1 R39.1 R48.1
N$25  (via drill 0.3)
  Top 0.254: U$1.2 23.88,61.09 R8.2 23.12,60.58 18.42,60.58 17.66,61.34 v15.88,61.34 | C5.+ 30.2,94.45 13.97,78.23 13.97,72.01 v13.47,71.5 | v14.1,61.34 13.97,61.47 13.97,67.18 13.47,67.69 v13.47,67.94
  Bottom 0.254: v14.1,61.34 v15.88,61.34 | v13.47,71.5 v13.47,67.94
N$26  (via drill 0.3)
  Top 0.254: R41.2 13.59,31.75 12.58,32.77 v11.31,32.77 | v6.86,35.56 6.86,40.89 10.04,44.07 10.04,45.59 9.4,46.23 9.4,50.8 12.45,53.85 R47.P$2
  Bottom 0.254: v11.31,32.77 9.66,32.77 v6.86,35.56
N$27  (via drill 0.3)
  Top 0.254: R21.1 R20.2 25.79,15.37 U$2.6 v25.79,21.21 | v25.79,22.61 U$2.9
  Bottom 0.254: v25.79,21.21 v25.79,22.61
N$28  (via drill 0.3)
  Top 0.254: T1.C C13.1 30.61,21.84 v30.61,22.48 | U$2.10 24.52,25.02 25.53,26.04 27.69,26.04 v28.2,26.54 27.82,26.92 v27.82,29.97 | IC3.4 26.8,36.2 v26.17,36.83
  Bottom 0.254: v28.2,26.54 28.2,24.89 v30.61,22.48 | v26.17,36.83 26.29,36.83 27.82,35.31 v27.82,29.97
N$29  (via drill 0.3)
  Top 0.254: U$2.7 27.05,20.7 28.83,22.48 29.47,22.48 C13.2 T2.C 29.59,32.38 v29.21,32.77 | v29.21,34.67 29.21,37.08 28.83,37.47 IC3.3
  Bottom 0.254: v29.21,32.77 v29.21,34.67
N$30  (via drill 0.3)
  Top 0.254: C14.1 T5.C v32.77,17.91 | v30.61,17.91 30.61,16.75 T1.E
  Bottom 0.254: v32.77,17.91 v30.61,17.91
N$31
  Top 0.254: C14.2 T3.C 32.73,26.54 31.37,26.54 30.55,25.71 T2.E
N$32
  Top 0.254: T6.C 35.95,19.05 34.74,20.26 | 34.74,20.26 34.67,20.32 C15.1 | T5.E 33.72,17.97 34.67,18.92 34.67,20.19 34.74,20.26
N$33
  Top 0.254: C15.2 33.72,23.31 T3.E 33.72,25.84 34.42,26.54 35.9,26.54 T4.C
N$34  (via drill 0.3)
  Top 0.254: T4.E 37.22,23.98 C16.2 36.71,22.86 v36.58,22.86 | U$2.5 24.52,17.14 v24.77,16.89
  Bottom 0.254: v24.77,16.89 27.18,16.89 32.9,22.61 36.33,22.61 v36.58,22.86
N$35  (via drill 0.3)
  Top 0.254: C16.1 36.9,20.51 T6.E 36.45,16.24 36.45,16.13 v35.82,15.49 | U$2.1 19.43,17.02 v19.56,16.89 | v21.47,14.1 22.1,13.46 27.69,13.46 v27.82,13.59
  Bottom 0.254: v19.56,16.89 19.56,16 v21.47,14.1 | v27.82,13.59 27.94,13.46 33.79,13.46 v35.82,15.49
N$36  (via drill 0.3)
  Top 0.254: R20.1 27.2,15.24 T1.B | T1.B 28.64,16.06 R23.2 | T1.B 28.64,20.51 v28.2,20.95 | v28.2,22.73 28.2,23.11 28.58,23.5 28.58,24.23 T2.B
  Bottom 0.254: v28.2,20.95 v28.2,22.73
N$37
  Top 0.254: T3.B T5.B 31.82,14.8 R23.1 R24.2
N$38  (via drill 0.3)
  Top 0.254: R25.1 R24.1 34.8,16.49 T6.B 34.99,17.84 v34.93,17.91 | v35.82,20.32 35.82,23.24 35.31,23.75 35.31,23.98 T4.B
  Bottom 0.254: v34.93,17.91 34.93,19.43 v35.82,20.32
N$39  (via drill 0.3)
  Top 0.254: C10.+ 26.42,91.44 13.34,78.36 13.34,74.93 9.66,71.25 9.66,67.82 13.34,64.14 13.34,59.82 13.85,59.31 13.85,48.26 13.47,47.88 13.47,46.61 7.75,40.89 v7.75,27.94 | v6.86,26.16 6.86,24.77 9.4,22.23 v11.05,22.23 | v13.09,22.23 16.01,22.23 17.28,20.95 20.07,20.95 20.7,20.32 U$2.2 20.7,16.76 20.07,16.13 20.07,14.48 21.59,12.95 36.33,12.95 36.52,12.76 | 36.52,12.76 36.58,12.7 | R26.2 36.52,12.76
  Bottom 0.254: v7.75,27.94 7.75,27.05 v6.86,26.16 | v11.05,22.23 v13.09,22.23
N$40
  Top 0.254: R28.2 20.83,22.1 21.98,20.95 U$2.3
N$41
  Top 0.254: R28.1 19.43,23.62 U$2.14
N$42
  Top 0.254: Q9.C 25.02,27.3 R44.1
N$43
  Top 0.254: 82K.1 R41.1 | R41.1 R40.1 R43.1 17.72,28.25 Q9.B | R41.1 15.12,31.5 R62.1 16.01,32.26 R42.1
N$44
  Top 0.254: R37.1 R36.1 25.91,100.36 C10.-
N$45
  Top 0.254: C11.+ 39.63,26.64 R29.2 40.52,21.34 R27.1 40.52,15.62 39.5,14.61 R25.2 R26.1
N$46
  Top 0.254: R30.2 38.99,17.78 R27.2 38.1,15.62 37.72,15.62 37.22,15.11 37.22,13.84 37.09,13.72 28.96,13.72 28.45,14.22 23.63,14.22 23.25,14.61 U$2.4
N$47
  Top 0.254: U$2.8 27.05,22.23 26.67,21.84 23.75,21.84 | 23.75,21.84 23.25,22.35 U$2.11 | R22.2 R21.2 22.61,15.37 22.61,21.21 23.25,21.84 23.75,21.84
N$48
  Top 0.254: R19.1 R18.1 33.91,99.98 C5.-
N$49
  Top 0.254: IC3.1 27.63,42.36 R31.1
N$50  (via drill 0.3)
  Top 0.254: R46.P$3 12.49,17.11 v2.16,27.43 | v2.16,29.97 2.16,32.38 4.32,34.54 4.32,35.53 C9.-
  Bottom 0.254: v2.16,27.43 v2.16,29.97
N$51  (via drill 0.3)
  Top 0.254: IC3.5 26.04,34.92 | 26.04,34.92 25.02,34.92 R34.1 24.26,35.69 v22.86,35.69 | IC3.7 26.17,32.38 v26.04,32.51 | v26.04,35.43 26.04,34.92 | T7.B 22.17,33.98 v22.23,34.04
  Bottom 0.254: v26.04,32.51 v26.04,35.43 | v22.23,34.04 22.23,35.05 v22.86,35.69
N$52  (via drill 0.3)
  Top 0.254: IC3.8 R32.1 25.02,30.86 v25.02,29.97 | C9.+ 4.83,40.51 6.23,39.12 6.23,33.4 v6.99,32.64 | v14.86,27.94 17.15,27.94 17.78,27.3 21.72,27.3 21.98,27.56 21.98,28.32 v22.99,29.34
  Bottom 0.254: v6.99,32.64 6.99,32.51 8.77,30.73 8.77,28.07 10.93,25.91 12.83,25.91 v14.86,27.94 | v22.99,29.34 24.39,29.34 v25.02,29.97
N$53
  Top 0.254: J3.TIP_T@3 R46.P$2
N$54  (via drill 0.3)
  Top 0.254: R45.P$1 R45.P$2 21.46,36.83 23.12,36.83 24.13,37.85 25.66,37.85 26.04,38.23 26.04,39.12 26.29,39.37 29.34,39.37 29.72,39.75 30.36,39.75 30.86,39.24 v30.86,35.31 | R30.1 38.48,24.89 v37.72,25.65
  Bottom 0.254: v37.72,25.65 33.91,25.65 30.86,28.7 v30.86,35.31
N$55
  Top 0.254: R45.P$3 22.65,38.44 20.83,40.26 12.07,40.26 11.94,40.39 11.94,41.31 C12.+
N$56
  Top 0.254: R61.P$1 R61.P$2 5.21,72.77 5.21,62.61 7.37,60.45 J1.TIP_T@3
N$57
  Top 0.254: R36.2 20.58,102.87 19.82,102.11 8.82,102.11 J2.TIP_T@3
N$58
  Top 0.254: R11.2 42.42,59.69 R7.2 39.88,58.29 37.09,55.5 36.04,55.5 C6.+ 35.78,55.41 33.28,57.91 28.07,57.91 27.31,57.15 25.53,57.15 25.15,57.53 25.15,58.04 24.26,58.93 | R8.1 24.26,58.93 | 24.26,58.93 R9.1
N$59
  Top 0.254: R12.2 26.55,58.04 R9.2 26.55,62.68 U$1.4
N$60
  Top 0.254: U$1.11 26.42,69.09 R3.2 R4.2 U$1.8
N$61
  Top 0.254: R13.1 32.26,40.13 32.13,40.01 IC3.16
N$62
  Top 0.254: R54.P$3 53.13,26.71 56.27,29.84 57.06,29.84 C4.-
N$63
  Top 0.254: T14.B 41.6,34.36 R16.1 | IC3.12 35.44,34.92 36.96,36.45 38.99,36.45 39.37,36.07 39.37,35.31 40.01,34.67 40.16,34.67 T14.B | IC3.10 38.36,32.38 40.01,34.04 40.15,34.04 T14.B
N$64
  Top 0.254: IC3.9 R14.1 37.47,28.83 49.66,28.83 50.3,29.46 51.41,30.61 C4.+
N$65
  Top 0.254: J9.TIP_T@3 R54.P$2
N$66  (via drill 0.3)
  Top 0.254: R53.P$2 R53.P$1 36.33,38.22 34.93,39.62 34.93,42.29 33.66,43.56 28.96,43.56 27.44,45.09 27.44,48.13 25.4,50.16 25.4,52.32 v25.28,52.45 | v25.28,55.12 25.28,55.24 R12.1
  Bottom 0.254: v25.28,52.45 v25.28,55.12
N$67
  Top 0.254: R53.P$3 47.62,38.22 49.41,40.01 49.41,40.67 C7.+
N$68
  Top 0.254: R63.P$2 R63.P$1 53.73,68.83 55.38,67.18 55.38,55.05 J7.TIP_T@3
N$69
  Top 0.254: R18.2 39.5,102.87 40.64,101.73 51.26,101.73 J8.TIP_T@3
N$70
  Top 0.254: IC11.2 29.59,45.85 R57.1 29.72,44.7 R56.2
N$71
  Top 0.254: IC11.3 30.86,49.66 32.01,50.8 36.71,50.8 38.48,52.58 44.33,52.58 46.99,55.24 47.88,55.24 49.28,56.64 49.28,64.77 45.16,68.89 45.16,71.55 R58.P$2
N$72
  Top 0.254: R19.2 42.35,104.14 J11.TIP_T@3
N$75  (via drill 0.3)
  Top 0.254: R61.P$3 3.94,74.93 1.53,72.52 1.53,29.08 3.56,27.05 v12.07,27.05 | v13.47,28.07 13.47,29.08 82K.2
  Bottom 0.254: v12.07,27.05 12.45,27.05 v13.47,28.07
N$76  (via drill 0.3)
  Top 0.254: R39.2 v20.7,72.39
  Bottom 0.254: v20.7,72.39 19.66,72.39 TM2.2
N$77  (via drill 0.3)
  Top 0.254: v13.47,33.78 R62.2
  Bottom 0.254: TM3.2 12.73,34.52 v13.47,33.78
N$78
  Top 0.254: R38.2 35.69,76.83 37.09,78.23 45.34,78.23 R63.P$3
N$126
  Top 0.254: IC11.6 30.86,55.75 R143.1 R152.2
N$127  (via drill 0.3)
  Top 0.254: IC11.5 32.13,55.63 v32.26,55.75 | v21.34,67.44 21.34,68.71 22.61,69.98 22.61,74.42 22.23,74.8 21.59,74.8 R1.P$2
  Bottom 0.254: v32.26,55.75 30.61,55.75 21.34,65.02 v21.34,67.44